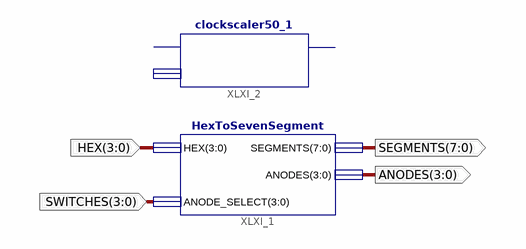
[diagram p0: schematic sheet 1]
// Xilinx ISE schematic muxdisplay.sch (spartan3e) as structural Verilog: 2 symbols, 4 ports
module muxdisplay (
  input  [3:0] HEX,
  input  [3:0] SWITCHES,
  output [3:0] ANODES,
  output [7:0] SEGMENTS
);

  HexToSevenSegment XLXI_1 (.HEX(HEX), .SEGMENTS(SEGMENTS), .ANODES(ANODES), .ANODE_SELECT(SWITCHES));
  clockscaler50_1 XLXI_2 ();  // open: clock_in, clock_select, clock_out
endmodule
